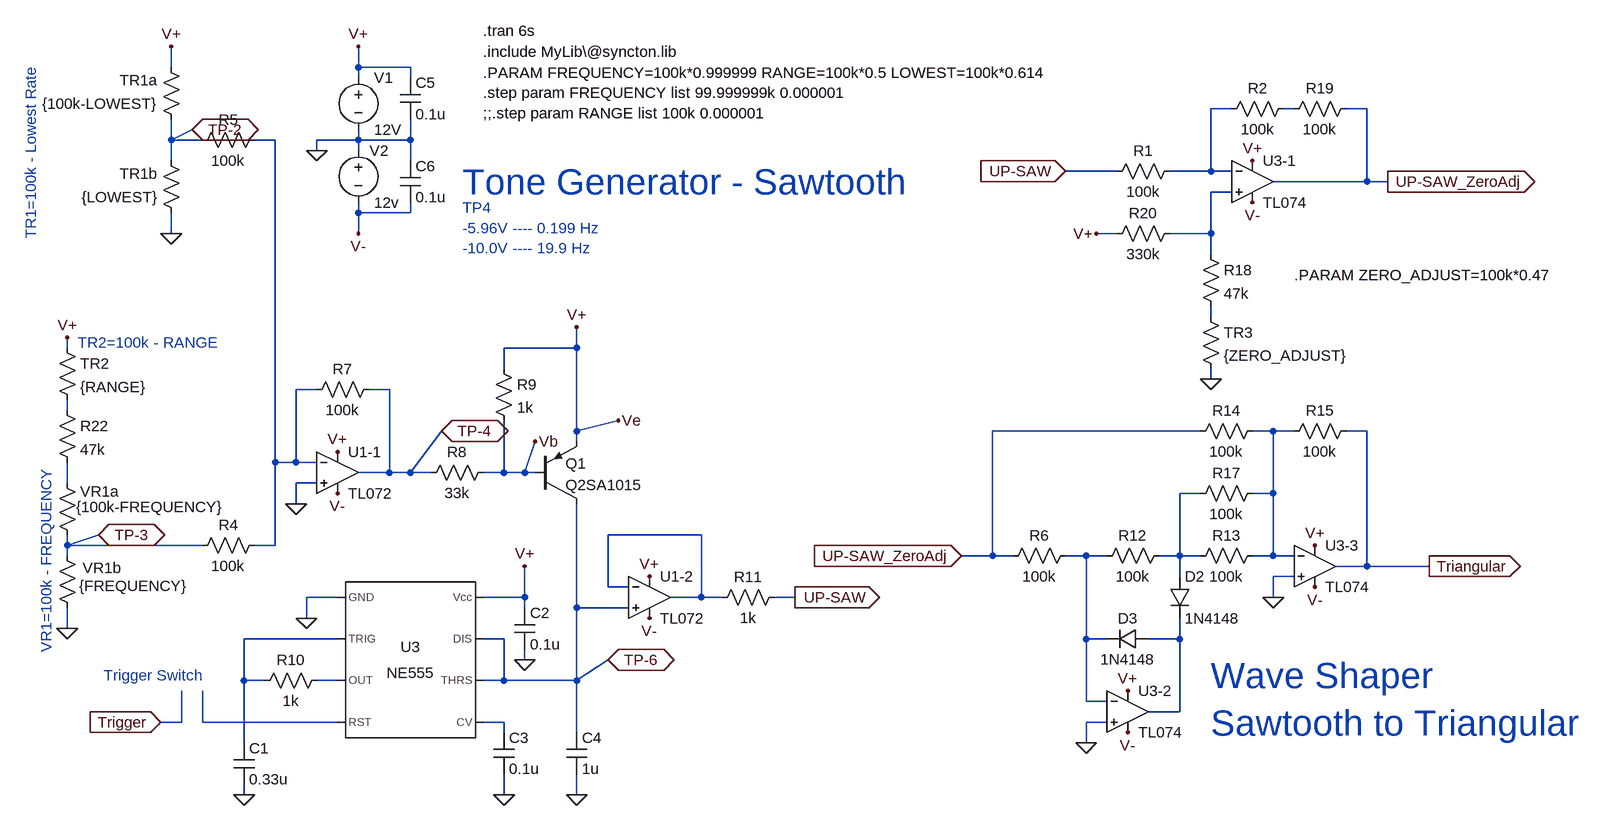
[diagram p0: schematic VCLFO1.asc]
VCLFO1.asc, the LTspice schematic file:
Version 4
SHEET 1 4496 2644
WIRE -400 640 -400 608
WIRE -112 640 -112 608
WIRE -32 640 -112 640
WIRE -112 656 -112 640
WIRE -32 656 -32 640
WIRE 1232 704 1200 704
WIRE 1328 704 1312 704
WIRE 1440 704 1408 704
WIRE -400 752 -400 720
WIRE -400 752 -368 736
WIRE -352 752 -400 752
WIRE -240 752 -272 752
WIRE -112 752 -112 736
WIRE -112 752 -176 752
WIRE -32 752 -32 720
WIRE -32 752 -112 752
WIRE -176 768 -176 752
WIRE -112 768 -112 752
WIRE -400 784 -400 752
WIRE -32 784 -32 752
WIRE 1056 800 976 800
WIRE 1200 800 1200 704
WIRE 1200 800 1136 800
WIRE 1232 800 1200 800
WIRE 1440 816 1440 704
WIRE 1440 816 1296 816
WIRE 1472 816 1440 816
WIRE 1232 832 1200 832
WIRE -112 864 -112 848
WIRE -32 864 -32 848
WIRE -32 864 -112 864
WIRE -400 896 -400 864
WIRE -112 896 -112 864
WIRE 1056 896 1024 896
WIRE 1200 896 1200 832
WIRE 1200 896 1136 896
WIRE 1200 928 1200 896
WIRE 1200 1024 1200 1008
WIRE -560 1072 -560 1056
WIRE 224 1072 224 1040
WIRE 224 1072 112 1072
WIRE 112 1104 112 1072
WIRE 1200 1120 1200 1104
WIRE -176 1136 -208 1136
WIRE -64 1136 -96 1136
WIRE -560 1168 -560 1152
WIRE 224 1200 224 1072
WIRE 224 1200 288 1184
WIRE 1184 1200 864 1200
WIRE 1296 1200 1264 1200
WIRE 1328 1200 1296 1200
WIRE 1440 1200 1408 1200
WIRE 224 1216 224 1200
WIRE -240 1248 -240 752
WIRE -208 1248 -208 1136
WIRE -208 1248 -240 1248
WIRE -176 1248 -208 1248
WIRE -64 1264 -64 1136
WIRE -64 1264 -112 1264
WIRE -32 1264 16 1200
WIRE -32 1264 -64 1264
WIRE 0 1264 -32 1264
WIRE 112 1264 112 1184
WIRE 112 1264 80 1264
WIRE 144 1264 160 1216
WIRE 144 1264 112 1264
WIRE 160 1264 144 1264
WIRE -560 1280 -560 1248
WIRE -176 1280 -208 1280
WIRE 1184 1296 1152 1296
WIRE 1296 1296 1296 1200
WIRE 1296 1296 1264 1296
WIRE -208 1312 -208 1280
WIRE 416 1360 272 1360
WIRE -560 1376 -560 1360
WIRE -560 1376 -512 1360
WIRE -352 1376 -560 1376
WIRE -240 1376 -240 1248
WIRE -240 1376 -272 1376
WIRE -560 1392 -560 1376
WIRE 864 1392 864 1200
WIRE 864 1392 816 1392
WIRE 896 1392 864 1392
WIRE 1008 1392 976 1392
WIRE 1040 1392 1008 1392
WIRE 1152 1392 1152 1296
WIRE 1152 1392 1120 1392
WIRE 1184 1392 1152 1392
WIRE 1296 1392 1296 1296
WIRE 1296 1392 1264 1392
WIRE 1328 1392 1296 1392
WIRE 1440 1408 1440 1200
WIRE 1440 1408 1392 1408
WIRE 1536 1408 1440 1408
WIRE 1152 1424 1152 1392
WIRE 1328 1424 1296 1424
WIRE 272 1440 272 1360
WIRE 304 1440 272 1440
WIRE -144 1456 -192 1456
WIRE 144 1456 144 1408
WIRE 144 1456 80 1456
WIRE 416 1456 416 1360
WIRE 416 1456 368 1456
WIRE 448 1456 416 1456
WIRE 560 1456 528 1456
WIRE 1296 1456 1296 1424
WIRE 144 1472 144 1456
WIRE 224 1472 224 1312
WIRE 304 1472 224 1472
WIRE -192 1488 -192 1456
WIRE -560 1504 -560 1472
WIRE -144 1520 -288 1520
WIRE 112 1520 80 1520
WIRE 1008 1520 1008 1392
WIRE 1040 1520 1008 1520
WIRE 1152 1520 1152 1488
WIRE 1152 1520 1104 1520
WIRE 144 1552 144 1536
WIRE -288 1584 -288 1520
WIRE -256 1584 -288 1584
WIRE -144 1584 -176 1584
WIRE 112 1584 112 1520
WIRE 112 1584 80 1584
WIRE 224 1584 224 1472
WIRE 224 1584 272 1552
WIRE 224 1584 112 1584
WIRE 1008 1616 1008 1520
WIRE 1040 1616 1008 1616
WIRE 1152 1632 1152 1520
WIRE 1152 1632 1104 1632
WIRE -384 1648 -384 1600
WIRE -384 1648 -416 1648
WIRE -352 1648 -352 1600
WIRE -144 1648 -352 1648
WIRE 112 1648 80 1648
WIRE 1040 1648 1008 1648
WIRE 112 1664 112 1648
WIRE 224 1664 224 1584
WIRE -288 1680 -288 1584
WIRE 1008 1680 1008 1648
WIRE -288 1760 -288 1744
WIRE 112 1760 112 1728
WIRE 224 1760 224 1728
FLAG -176 768 0
FLAG -112 608 V+
FLAG -112 896 V-
FLAG -144 1232 V+
FLAG -144 1296 V-
FLAG -208 1312 0
FLAG 144 1408 V+
FLAG 112 1760 0
FLAG 144 1552 0
FLAG -192 1488 0
FLAG -288 1760 0
FLAG -416 1648 Trigger
IOPIN -416 1648 In
FLAG -368 736 TP-2
IOPIN -368 736 BiDir
FLAG 16 1200 TP-4
IOPIN 16 1200 BiDir
FLAG -512 1360 TP-3
IOPIN -512 1360 BiDir
FLAG 272 1552 TP-6
IOPIN 272 1552 BiDir
FLAG 224 1040 V+
FLAG 160 1216 Vb
FLAG 288 1184 Ve
FLAG 336 1424 V+
FLAG 336 1488 V-
FLAG 224 1760 0
FLAG 560 1456 UP-SAW
IOPIN 560 1456 Out
FLAG 976 800 UP-SAW
IOPIN 976 800 In
FLAG 1072 1600 V+
FLAG 1360 1376 V+
FLAG 1360 1440 V-
FLAG 1072 1664 V-
FLAG 1008 1680 0
FLAG 1296 1456 0
FLAG 1536 1408 Triangular
IOPIN 1536 1408 Out
FLAG 1264 784 V+
FLAG 1264 848 V-
FLAG 1200 1120 0
FLAG 1024 896 V+
FLAG 816 1392 UP-SAW_ZeroAdj
IOPIN 816 1392 In
FLAG -400 608 V+
FLAG -560 1504 0
FLAG -400 896 0
FLAG -560 1056 V+
FLAG 1472 816 UP-SAW_ZeroAdj
IOPIN 1472 816 Out
SYMBOL voltage -112 640 R0
WINDOW 123 0 0 Left 2
WINDOW 39 0 0 Left 2
SYMATTR InstName V1
SYMATTR Value 12V
SYMBOL voltage -112 752 R0
WINDOW 123 0 0 Left 2
WINDOW 39 0 0 Left 2
WINDOW 0 17 16 Left 2
SYMATTR InstName V2
SYMATTR Value 12v
SYMBOL res -544 1376 R180
WINDOW 0 -64 83 Left 2
WINDOW 3 -225 59 Left 2
SYMATTR InstName VR1a
SYMATTR Value {100k-FREQUENCY}
SYMBOL Opamps\\opamp2 -144 1200 R0
SYMATTR InstName U1-1
SYMATTR Value TL072
SYMBOL res -368 1392 R270
WINDOW 0 32 56 VTop 2
WINDOW 3 0 56 VBottom 2
SYMATTR InstName R4
SYMATTR Value 100k
SYMBOL res -192 1152 R270
WINDOW 0 32 56 VTop 2
WINDOW 3 0 56 VBottom 2
SYMATTR InstName R7
SYMATTR Value 100k
SYMBOL res -368 768 R270
WINDOW 0 32 56 VTop 2
WINDOW 3 0 56 VBottom 2
SYMATTR InstName R5
SYMATTR Value 100k
SYMBOL res -384 736 R180
WINDOW 0 36 76 Left 2
WINDOW 3 36 40 Left 2
SYMATTR InstName TR1a
SYMATTR Value {100k-LOWEST}
SYMBOL res -384 880 R180
WINDOW 0 36 76 Left 2
WINDOW 3 36 40 Left 2
SYMATTR InstName TR1b
SYMATTR Value {LOWEST}
SYMBOL Misc\\NE555 -32 1552 R0
SYMATTR InstName U3
SYMBOL cap 96 1664 R0
SYMATTR InstName C3
SYMATTR Value 0.1u
SYMBOL cap 128 1472 R0
SYMATTR InstName C2
SYMATTR Value 0.1u
SYMBOL cap 208 1664 R0
SYMATTR InstName C4
SYMATTR Value 1u
SYMBOL cap -304 1680 R0
SYMATTR InstName C1
SYMATTR Value 0.33u
SYMBOL res -272 1600 R270
WINDOW 0 32 56 VTop 2
WINDOW 3 0 56 VBottom 2
SYMATTR InstName R10
SYMATTR Value 1k
SYMBOL pnp 160 1312 M180
WINDOW 0 47 62 Left 2
WINDOW 3 47 29 Left 2
SYMATTR InstName Q1
SYMATTR Value Q2SA1015
SYMBOL res -16 1280 R270
WINDOW 0 32 56 VTop 2
WINDOW 3 0 56 VBottom 2
SYMATTR InstName R8
SYMATTR Value 33k
SYMBOL Opamps\\opamp2 336 1392 R0
SYMATTR InstName U1-2
SYMATTR Value TL072
SYMBOL cap -48 656 R0
SYMATTR InstName C5
SYMATTR Value 0.1u
SYMBOL cap -48 784 R0
SYMATTR InstName C6
SYMATTR Value 0.1u
SYMBOL res 880 1408 R270
WINDOW 0 32 56 VTop 2
WINDOW 3 0 56 VBottom 2
SYMATTR InstName R6
SYMATTR Value 100k
SYMBOL res 1024 1408 R270
WINDOW 0 32 56 VTop 2
WINDOW 3 0 56 VBottom 2
SYMATTR InstName R12
SYMATTR Value 100k
SYMBOL res 1168 1408 R270
WINDOW 0 32 56 VTop 2
WINDOW 3 0 56 VBottom 2
SYMATTR InstName R13
SYMATTR Value 100k
SYMBOL res 1168 1216 R270
WINDOW 0 32 56 VTop 2
WINDOW 3 0 56 VBottom 2
SYMATTR InstName R14
SYMATTR Value 100k
SYMBOL res 1312 1216 R270
WINDOW 0 32 56 VTop 2
WINDOW 3 0 56 VBottom 2
SYMATTR InstName R15
SYMATTR Value 100k
SYMBOL diode 1136 1424 R0
SYMATTR InstName D2
SYMATTR Value 1N4148
SYMBOL diode 1104 1504 R90
WINDOW 0 0 32 VBottom 2
WINDOW 3 32 32 VTop 2
SYMATTR InstName D3
SYMATTR Value 1N4148
SYMBOL Opamps\\opamp2 1072 1568 R0
SYMATTR InstName U3-2
SYMATTR Value TL074
SYMBOL Opamps\\opamp2 1360 1344 R0
SYMATTR InstName U3-3
SYMATTR Value TL074
SYMBOL Opamps\\opamp2 1264 752 R0
SYMATTR InstName U3-1
SYMATTR Value TL074
SYMBOL res 1040 816 R270
WINDOW 0 32 56 VTop 2
WINDOW 3 0 56 VBottom 2
SYMATTR InstName R1
SYMATTR Value 100k
SYMBOL res 1216 720 R270
WINDOW 0 32 56 VTop 2
WINDOW 3 0 56 VBottom 2
SYMATTR InstName R2
SYMATTR Value 100k
SYMBOL res 1040 912 R270
WINDOW 0 32 56 VTop 2
WINDOW 3 0 56 VBottom 2
SYMATTR InstName R20
SYMATTR Value 330k
SYMBOL res 1184 1008 R0
SYMATTR InstName TR3
SYMATTR Value {ZERO_ADJUST}
SYMBOL res 1168 1312 R270
WINDOW 0 32 56 VTop 2
WINDOW 3 0 56 VBottom 2
SYMATTR InstName R17
SYMATTR Value 100k
SYMBOL res 1312 720 R270
WINDOW 0 32 56 VTop 2
WINDOW 3 0 56 VBottom 2
SYMATTR InstName R19
SYMATTR Value 100k
SYMBOL res 1184 912 R0
SYMATTR InstName R18
SYMATTR Value 47k
SYMBOL res 432 1472 R270
WINDOW 0 32 56 VTop 2
WINDOW 3 0 56 VBottom 2
SYMATTR InstName R11
SYMATTR Value 1k
SYMBOL res -544 1488 R180
WINDOW 0 -68 77 Left 2
WINDOW 3 -169 50 Left 2
SYMATTR InstName VR1b
SYMATTR Value {FREQUENCY}
SYMBOL res 96 1088 R0
SYMATTR InstName R9
SYMATTR Value 1k
SYMBOL res -576 1152 R0
SYMATTR InstName R22
SYMATTR Value 47k
SYMBOL res -576 1056 R0
SYMATTR InstName TR2
SYMATTR Value {RANGE}
TEXT 80 616 Left 2 !.include MyLib\\@syncton.lib
TEXT -592 1256 VRight 2 ;VR1=100k - FREQUENCY
TEXT -616 904 VLeft 2 ;TR1=100k - Lowest Rate
TEXT 80 648 Left 2 !.PARAM FREQUENCY=100k*0.999999 RANGE=100k*0.5 LOWEST=100k*0.614\n.step param FREQUENCY list 99.999999k 0.000001\n;;.step param RANGE list 100k 0.000001
TEXT -504 1576 Left 2 ;Trigger Switch
TEXT 48 816 Left 5 ;Tone Generator - Sawtooth
TEXT 48 856 Left 2 ;TP4\n-5.96V ---- 0.199 Hz\n-10.0V ---- 19.9 Hz
TEXT 80 584 Left 2 !.tran 6s
TEXT 1328 960 Left 2 !.PARAM ZERO_ADJUST=100k*0.47
TEXT 1200 1576 Left 5 ;Wave Shaper\nSawtooth to Triangular
TEXT -544 1064 Left 2 ;TR2=100k - RANGE

The netlist it stands for:
* VCLFO1.asc
V1 Ve 0 12V
V2 0 V- 12v
R§VR1a TP-3 N008 {100k-FREQUENCY}
XU1-1 0 N003 Ve V- TP-4 TL072  ; pins In+ In- V+ V- OUT
R4 TP-3 N003 100k
R7 N003 TP-4 100k
R5 TP-2 N003 100k
R§TR1a TP-2 Ve {100k-LOWEST}
R§TR1b 0 TP-2 {LOWEST}
XU3 0 N012 N014 N015 N016 TP-6 TP-6 Ve NE555  ; pins GND TRIG OUT RST CV THRS DIS Vcc
C3 N016 0 0.1u
C2 Ve 0 0.1u
C4 TP-6 0 1u
C1 N012 0 0.33u
R10 N012 N014 1k
Q1 TP-6 Vb Ve 0 Q2SA1015
R8 TP-4 Vb 33k
XU1-2 TP-6 N010 Ve V- N010 TL072  ; pins In+ In- V+ V- OUT
C5 Ve 0 0.1u
C6 0 V- 0.1u
R6 UP-SAW_ZeroAdj N011 100k
R12 N011 N009 100k
R13 N009 N007 100k
R14 UP-SAW_ZeroAdj N007 100k
R15 N007 Triangular 100k
D2 N009 N013 1N4148
D3 N013 N011 1N4148
XU3-2 0 N011 Ve V- N013 TL074  ; pins In+ In- V+ V- OUT
XU3-3 0 N007 Ve V- Triangular TL074  ; pins In+ In- V+ V- OUT
XU3-1 N004 N001 Ve V- UP-SAW_ZeroAdj TL074  ; pins In+ In- V+ V- OUT
R1 UP-SAW N001 100k
R2 N001 N002 100k
R20 Ve N004 330k
R§TR3 N005 0 {ZERO_ADJUST}
R17 N009 N007 100k
R19 N002 UP-SAW_ZeroAdj 100k
R18 N004 N005 47k
R11 N010 UP-SAW 1k
R§VR1b 0 TP-3 {FREQUENCY}
R9 Ve Vb 1k
R22 N006 N008 47k
R§TR2 Ve N006 {RANGE}
.model D D
.lib standard.dio
.model NPN NPN
.model PNP PNP
.lib standard.bjt
.include MyLib\@syncton.lib
* VR1=100k - FREQUENCY
* TR1=100k - Lowest Rate
.PARAM FREQUENCY=100k*0.999999 RANGE=100k*0.5 LOWEST=100k*0.614
.step param FREQUENCY list 99.999999k 0.000001
;;.step param RANGE list 100k 0.000001
* Trigger Switch
* Tone Generator - Sawtooth
* TP4
* -5.96V ---- 0.199 Hz
* -10.0V ---- 19.9 Hz
.tran 6s
.PARAM ZERO_ADJUST=100k*0.47
* Wave Shaper
* Sawtooth to Triangular
* TR2=100k - RANGE
.lib NE555.sub
.backanno
.end